# Altium schematic sheet interface.SchDoc
size A4; SheetNumber: 2; SheetTotal: 4
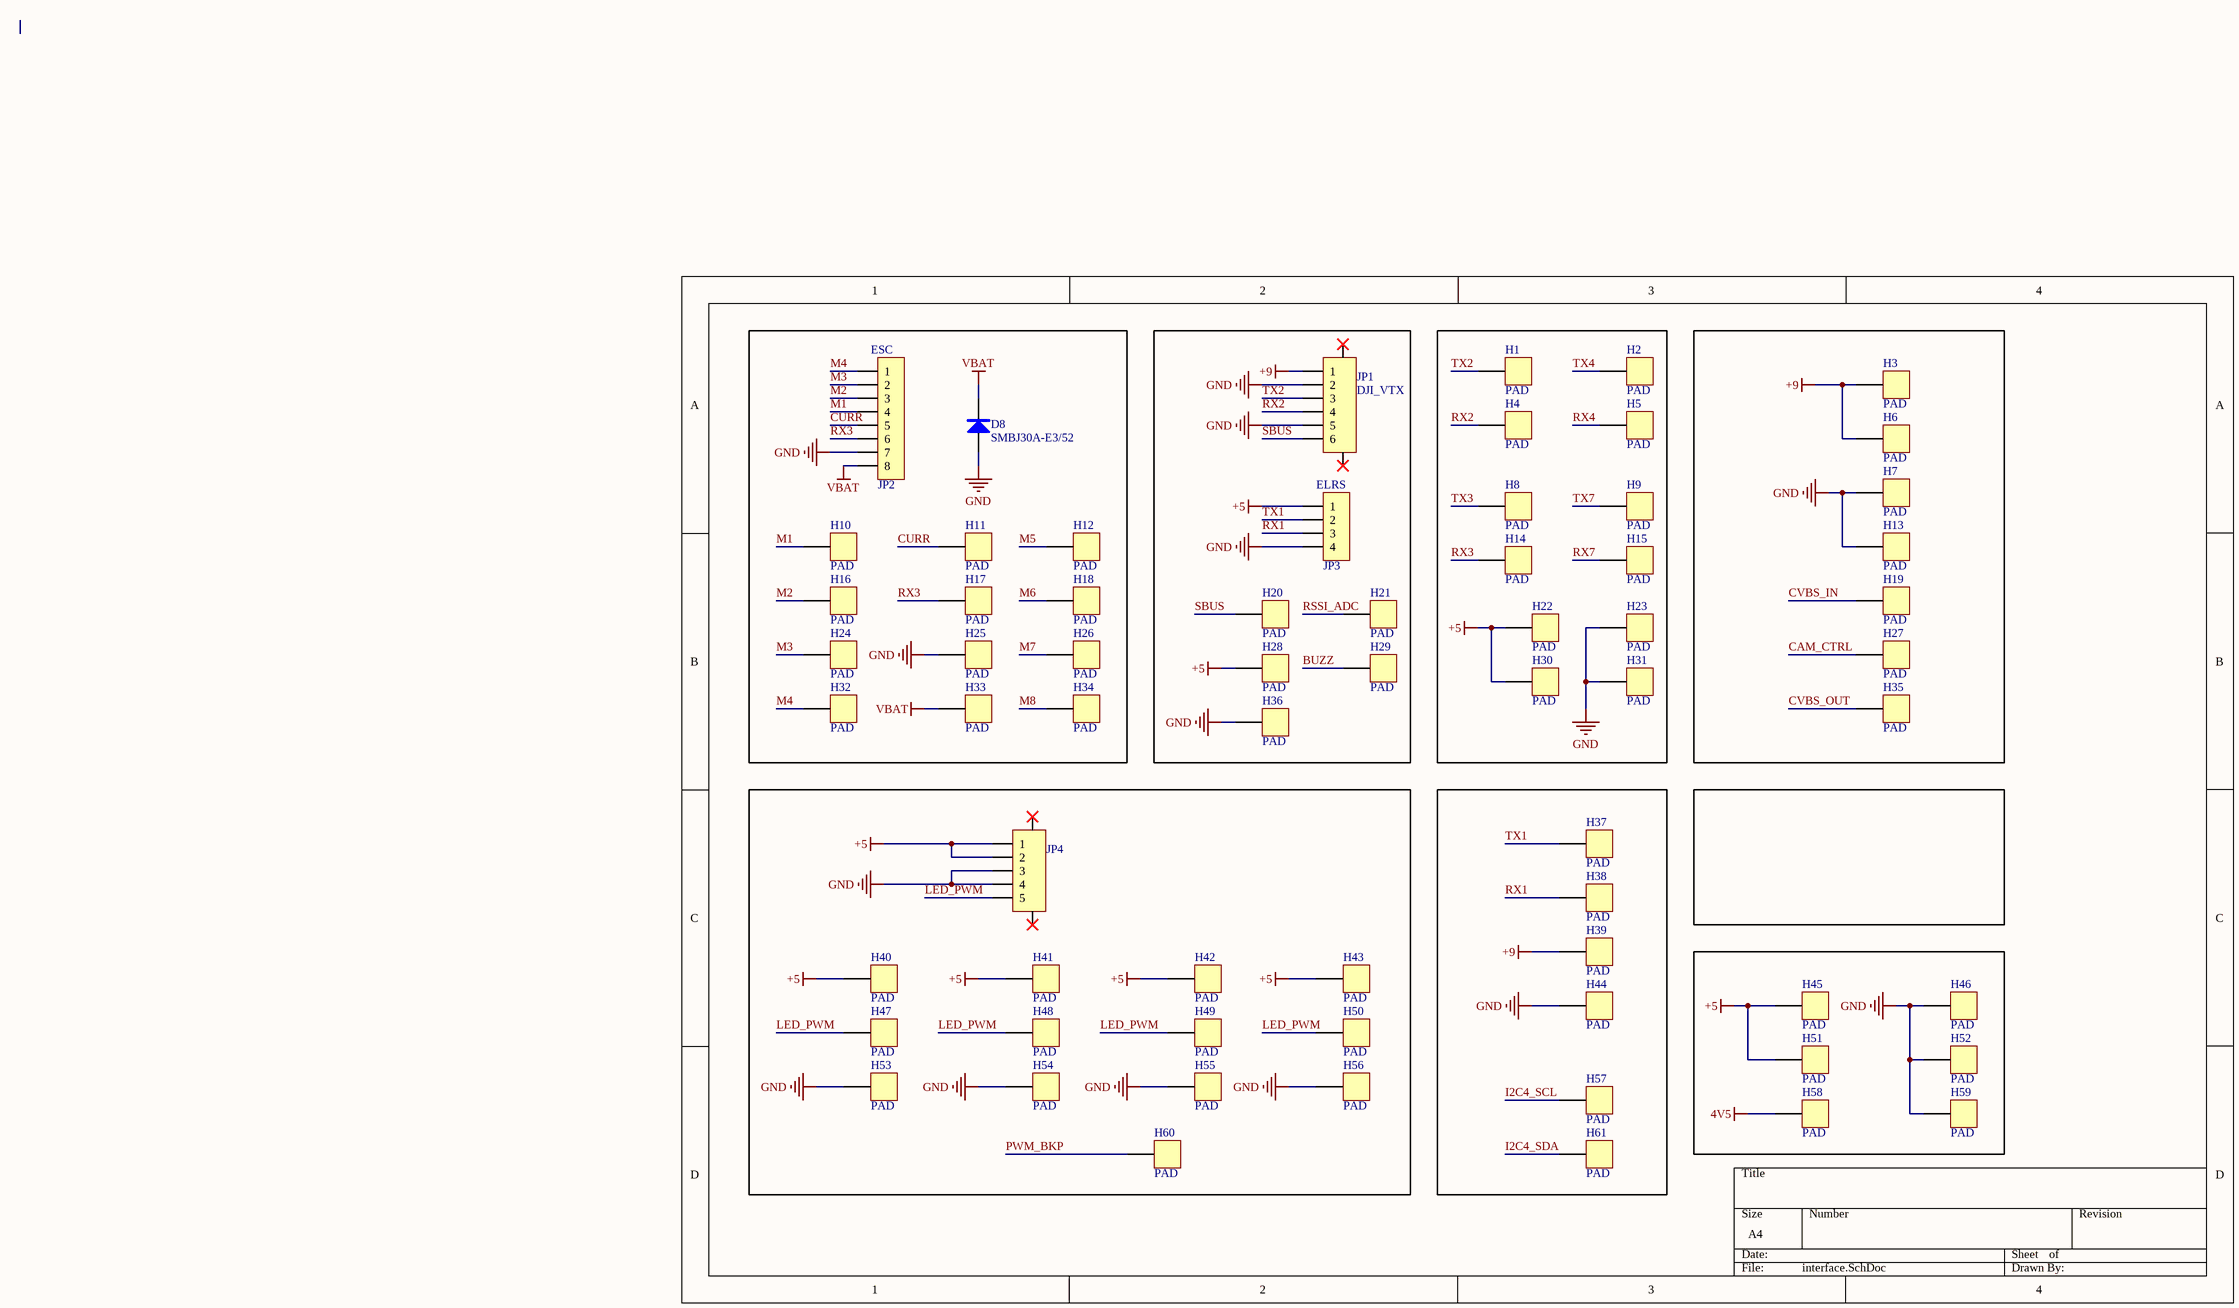
[diagram p0: interface.SchDoc]

## Parts
D8  SMBJ30A-E3/52  [SMB]
H1  PAD  [Pad 4]
H2  PAD  [Pad 4]
H3  PAD  [Pad 4]
H4  PAD  [Pad 4]
H5  PAD  [Pad 4]
H6  PAD  [Pad 4]
H7  PAD  [Pad 4]
H8  PAD  [Pad 4]
H9  PAD  [Pad 4]
H10  PAD  [Pad 4]
H11  PAD  [Pad 4]
H12  PAD  [Pad 4]
H13  PAD  [Pad 4]
H14  PAD  [Pad 4]
H15  PAD  [Pad 4]
H16  PAD  [Pad 4]
H17  PAD  [Pad 4]
H18  PAD  [Pad 4]
H19  PAD  [Pad 4]
H20  PAD  [Pad 4]
H21  PAD  [Pad 4]
H22  PAD  [Pad 4]
H23  PAD  [Pad 4]
H24  PAD  [Pad 4]
H25  PAD  [Pad 4]
H26  PAD  [Pad 4]
H27  PAD  [Pad 4]
H28  PAD  [Pad 4]
H29  PAD  [Pad 4]
H30  PAD  [Pad 4]
H31  PAD  [Pad 4]
H32  PAD  [Pad 4]
H33  PAD  [Pad 4]
H34  PAD  [Pad 4]
H35  PAD  [Pad 4]
H36  PAD  [Pad 4]
H37  PAD  [Pad 4]
H38  PAD  [Pad 4]
H39  PAD  [Pad 4]
H40  PAD  [Pad 2]
H41  PAD  [Pad 2]
H42  PAD  [Pad 2]
H43  PAD  [Pad 2]
H44  PAD  [Pad 4]
H45  PAD  [Pad 4]
H46  PAD  [Pad 4]
H47  PAD  [Pad 2]
H48  PAD  [Pad 2]
H49  PAD  [Pad 2]
H50  PAD  [Pad 2]
H51  PAD  [Pad 4]
H52  PAD  [Pad 4]
H53  PAD  [Pad 2]
H54  PAD  [Pad 2]
H55  PAD  [Pad 2]
H56  PAD  [Pad 2]
H57  PAD  [Pad 4]
H58  PAD  [Pad 2]
H59  PAD  [Pad 2]
H60  PAD  [Pad 2]
H61  PAD  [Pad 4]
JP1  CON-6P  [SH1.0-WT-6P]  (value not drawn)
JP2  CON-8P  [SH1.0-WT-8P]  (value not drawn)
JP3  CON-4P  [SH1.0-WT-4P]  (value not drawn)
JP4  CON-5P  [SH1.0-WT-5P]  (value not drawn)

## Blocks framed on the sheet
ESC: D8 H10-H12 H16-H18 H24-H26 H32-H34 JP2

## Nets
4V5: H58.1
+5: H22.1 H28.1 H30.1 H40.1 H41.1 H42.1 H43.1 H45.1 H51.1 JP3.1 JP4.1 JP4.2
+9: H3.1 H6.1 H39.1 JP1.1
GND: D8.1(A) H7.1 H13.1 H23.1 H25.1 H31.1 H36.1 H44.1 H46.1 H52.1 H53.1 H54.1 H55.1 H56.1 H59.1 JP1.2 JP1.5 JP2.7 JP3.4 JP4.3 JP4.4
VBAT: D8.2(K) H33.1 JP2.8
BUZZ: H29.1
CAM_CTRL: H27.1
CURR: H11.1 JP2.5
CVBS_IN: H19.1
CVBS_OUT: H35.1
I2C4_SCL: H57.1
I2C4_SDA: H61.1
LED_PWM: H47.1 H48.1 H49.1 H50.1 JP4.5
M1: H10.1 JP2.4
M2: H16.1 JP2.3
M3: H24.1 JP2.2
M4: H32.1 JP2.1
M5: H12.1
M6: H18.1
M7: H26.1
M8: H34.1
PWM_BKP: H60.1
RSSI_ADC: H21.1
RX1: H38.1 JP3.3
RX2: H4.1 JP1.4
RX3: H14.1 H17.1 JP2.6
RX4: H5.1
RX7: H15.1
SBUS: H20.1 JP1.6
TX1: H37.1 JP3.2
TX2: H1.1 JP1.3
TX3: H8.1
TX4: H2.1
TX7: H9.1

Not connected (* = marked no-connect by the designer): JP1 0*; JP4 0*

## Notes on the sheet
- (near JP1) DJI_VTX
- (near JP3) ELRS

## Library data of the parts
D8 = SMBJ30A-E3/52: 30V 600W 瞬态抑制二极管(TVS); BOM名称: TVS瞬态抑制二极管; 属性: 30V 600W
H1-H61 = PAD: Pads
JP1 = Header 6: 6P连接器; BOM名称: 6P连接器
JP2 = Header 8: 8P连接器; BOM名称: 8P连接器
JP3 = Header 4: 4P连接器; BOM名称: 4P连接器
JP4 = Header 5: 5P连接器; BOM名称: 5P连接器